# Altium project axidraw.PrjPcb
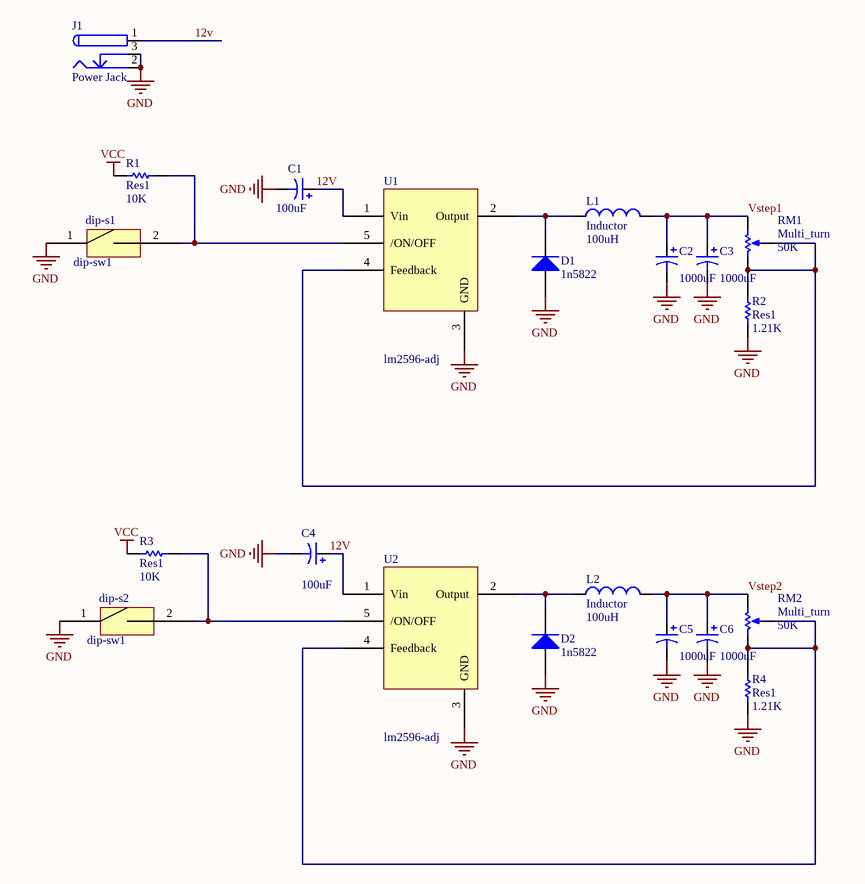
[diagram p0: power1.SchDoc]
6 sheets, 113 parts. Net scope: global (net labels, ports and power ports of the same name join across sheets).
Board file: plotter.PcbDoc
Sheets:
  power1.SchDoc
  power2.SchDoc
  step-drive.SchDoc
  accessory.SchDoc
  accessory2.SchDoc
  main.SchDoc

## Sheet power1.SchDoc
size A

### Parts
C1  value 100uF  [CAP ALUM 6.6MM]
C2  value 1000uF  [CAP ALUM 10.3MM]
C3  value 1000uF  [CAP ALUM 10.3MM]
C4  value 100uF  [CAP ALUM 6.6MM]
C5  value 1000uF  [CAP ALUM 10.3MM]
C6  value 1000uF  [CAP ALUM 10.3MM]
D1  1n5822  [DO214AC SMA]
D2  1n5822  [DO214AC SMA]
dip-s1  dip-sw1  [DIP2]
dip-s2  dip-sw1  [DIP2]
J1  Power Jack  [Power Jack]
L1  Inductor  value 100uH  [inductor - 12x12x7]
L2  Inductor  value 100uH  [inductor - 12x12x7]
R1  Res1  value 10K  [RES 1206/3216]
R2  Res1  value 1.21K  [RES 1206/3216]
R3  Res1  value 10K  [RES 1206/3216]
R4  Res1  value 1.21K  [RES 1206/3216]
RM1  Multi_turn  value 50K  [Multi Turn 02]
RM2  Multi_turn  value 50K  [Multi Turn 02]
U1  lm2596-adj  [DPAK170P1430X238-6N]
U2  lm2596-adj  [DPAK170P1430X238-6N]

### Nets
GND: C1.2 C2.2 C3.2 C4.2 C5.2 C6.2 D1.1(A) D2.1(A) dip-s1.1(k) dip-s2.1(k) J1.2 J1.3 R2.1 R4.1 U1.3(GND) U2.3(GND)
Vcc: R1.2 R3.2
12V: C1.1 C4.1 J1.1 U1.1(Vin) U2.1(Vin)
Vstep1: C2.1 C3.1 L1.2 RM1.1(TOP)
Vstep2: C5.1 C6.1 L2.2 RM2.1(TOP)
NetD1_2: D1.2(K) L1.1 U1.2(Output)
NetD2_2: D2.2(K) L2.1 U2.2(Output)
Netdip-s1_2: dip-s1.2(k) R1.1 U1.5(/ON/OFF)
Netdip-s2_2: dip-s2.2(k) R3.1 U2.5(/ON/OFF)
NetR2_2: R2.2 RM1.2(BOT) RM1.3(TAP) U1.4(Feedback)
NetR4_2: R4.2 RM2.2(BOT) RM2.3(TAP) U2.4(Feedback)

### Library data of the parts
C1-C6 = Cap Pol1: Polarized Capacitor (Radial); Published: 8-Jun-2000; LatestRevisionDate: 17-Jul-2002; LatestRevisionNote: Re-released for DXP Platform.; PackageReference: RB7.6-15; Publisher: Altium Limited; PackageDescription: Polarized Capacitor (Radial); 2 Leads
D1 D2 = Diode 1N4007: 1 Amp General Purpose Rectifier; Published: 8-Jun-2000; LatestRevisionDate: 17-Jul-2002; LatestRevisionNote: Re-released for DXP Platform.; DatasheetVersion: 1998; PackageVersion: Aug-1999; PackageReference: DO-41; Publisher: Altium Limited; PackageDescription: Diode, Axial; Body 5.2 x 2.7 mm (LxDia. max), Lead Dia. 0.86 mm (max); Code_JEDEC: DO-204-AL; ComponentLink1Description: Manufacturer Link; ComponentLink1URL: http://www.fairchildsemi.com/; ComponentLink2Description: Datasheet; ComponentLink2URL: http://www.fairchildsemi.com/ds/1N%2F1N4001.pdf
J1 = Power Jack: Designer: Saeid Jorablo; Company: Personal; Project Name: Laser; Adding Date: 10/21/2009
L1 L2 = Inductor: Code_IEC: 1005; Published: 8-Jun-2000; LatestRevisionDate: 29-May-2009; LatestRevisionNote: IPC-7351 Footprint Added.; PackageReference: 0402-A; Publisher: Altium Limited; PackageDescription: Chip Inductor; Code_JEITA: 0402
R1-R4 = Res1: Resistor; Published: 8-Jun-2000; LatestRevisionDate: 17-Jul-2002; LatestRevisionNote: Re-released for DXP Platform.; PackageReference: AXIAL-0.3; Publisher: Altium Limited; PackageDescription: Axial Device, Thru-Hole; 2 Leads; 0.3 in Pin Spacing
RM1 RM2 = Multi_turn: Potentiometer; Sim Note: Enter the Resistance value and the set point into parameter fields.; Set Position: 0.5; Published: 8-Jun-2000; LatestRevisionDate: 17-Jul-2002; LatestRevisionNote: Re-released for DXP Platform.; PackageReference: VR5; Publisher: Altium Limited
U1 U2 = lm2596

## Sheet power2.SchDoc
size A
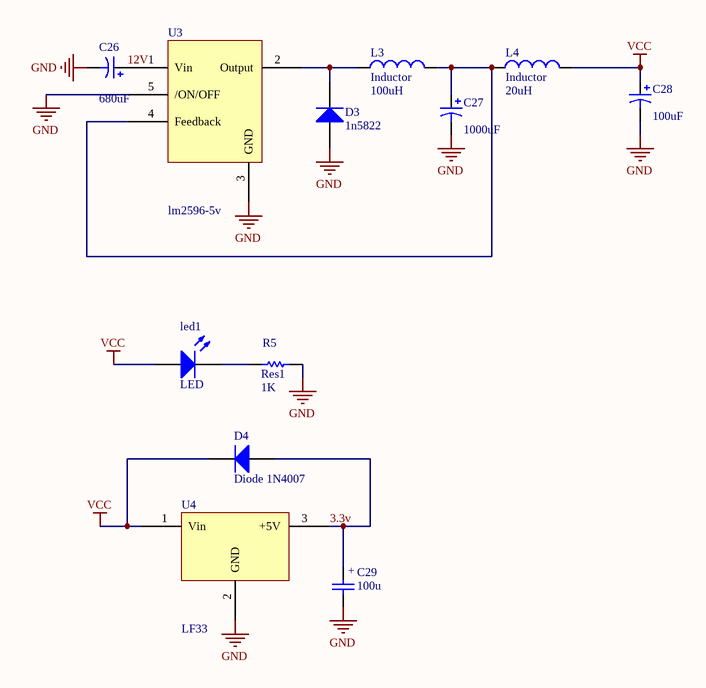
[diagram p1: power2.SchDoc]

### Parts
C26  value 680uF  [CAP ALUM 10.3MM]
C27  value 1000uF  [CAP ALUM 10.3MM]
C28  value 100uF  [CAP ALUM 6.6MM]
C29  value 100u  [CAP ALUM 6.6MM]  (hidden comment: Cap)
D3  1n5822  [DO214AC SMA]
D4  Diode 1N4007  [DO214AC SMA]
L3  Inductor  value 100uH  [inductor - 12x12x7]
L4  Inductor  value 20uH  [inductor - 12x12x7]
led1  LED  [LED 1206/3216 RED]
R5  Res1  value 1K  [RES 1206/3216]
U3  lm2596-5v  [DPAK170P1430X238-6N]
U4  LF33  [REG-7805-WALL]

### Nets
GND: C26.2 C27.2 C28.2 C29.- D3.1(A) R5.2 U3.3(GND) U3.5(/ON/OFF) U4.2(GND)
Vcc: C28.1 D4.2(K) L4.2 led1.A U4.1(Vin)
3.3v: C29.+ D4.1(A) U4.3(+5V)
12V: C26.1 U3.1(Vin)
NetC27_1: C27.1 L3.2 L4.1 U3.4(Feedback)
NetD3_2: D3.2(K) L3.1 U3.2(Output)
Netled1_K: led1.K R5.1

### Library data of the parts
C26-C28 = Cap Pol1: Polarized Capacitor (Radial); Published: 8-Jun-2000; LatestRevisionDate: 17-Jul-2002; LatestRevisionNote: Re-released for DXP Platform.; PackageReference: RB7.6-15; Publisher: Altium Limited; PackageDescription: Polarized Capacitor (Radial); 2 Leads
C29 = Cap Pol: CAP-3300Uf; pin to pad: +>1 ->2
D3 D4 = Diode 1N4007: 1 Amp General Purpose Rectifier; Published: 8-Jun-2000; LatestRevisionDate: 17-Jul-2002; LatestRevisionNote: Re-released for DXP Platform.; DatasheetVersion: 1998; PackageVersion: Aug-1999; PackageReference: DO-41; Publisher: Altium Limited; PackageDescription: Diode, Axial; Body 5.2 x 2.7 mm (LxDia. max), Lead Dia. 0.86 mm (max); Code_JEDEC: DO-204-AL; ComponentLink1Description: Manufacturer Link; ComponentLink1URL: http://www.fairchildsemi.com/; ComponentLink2Description: Datasheet; ComponentLink2URL: http://www.fairchildsemi.com/ds/1N%2F1N4001.pdf
L3 L4 = Inductor: Code_IEC: 1005; Published: 8-Jun-2000; LatestRevisionDate: 29-May-2009; LatestRevisionNote: IPC-7351 Footprint Added.; PackageReference: 0402-A; Publisher: Altium Limited; PackageDescription: Chip Inductor; Code_JEITA: 0402
led1 = LED: Typical INFRARED GaAs LED; pin to pad: A>1 K>2; Published: 8-Jun-2000; LatestRevisionDate: 08-Jul-2005; LatestRevisionNote: Mech Layer 1 removed.; Publisher: Altium Limited
R5 = Res1: Resistor; Published: 8-Jun-2000; LatestRevisionDate: 17-Jul-2002; LatestRevisionNote: Re-released for DXP Platform.; PackageReference: AXIAL-0.3; Publisher: Altium Limited; PackageDescription: Axial Device, Thru-Hole; 2 Leads; 0.3 in Pin Spacing
U3 = lm2596
U4 = 7805: Regulator

## Sheet step-drive.SchDoc
size A
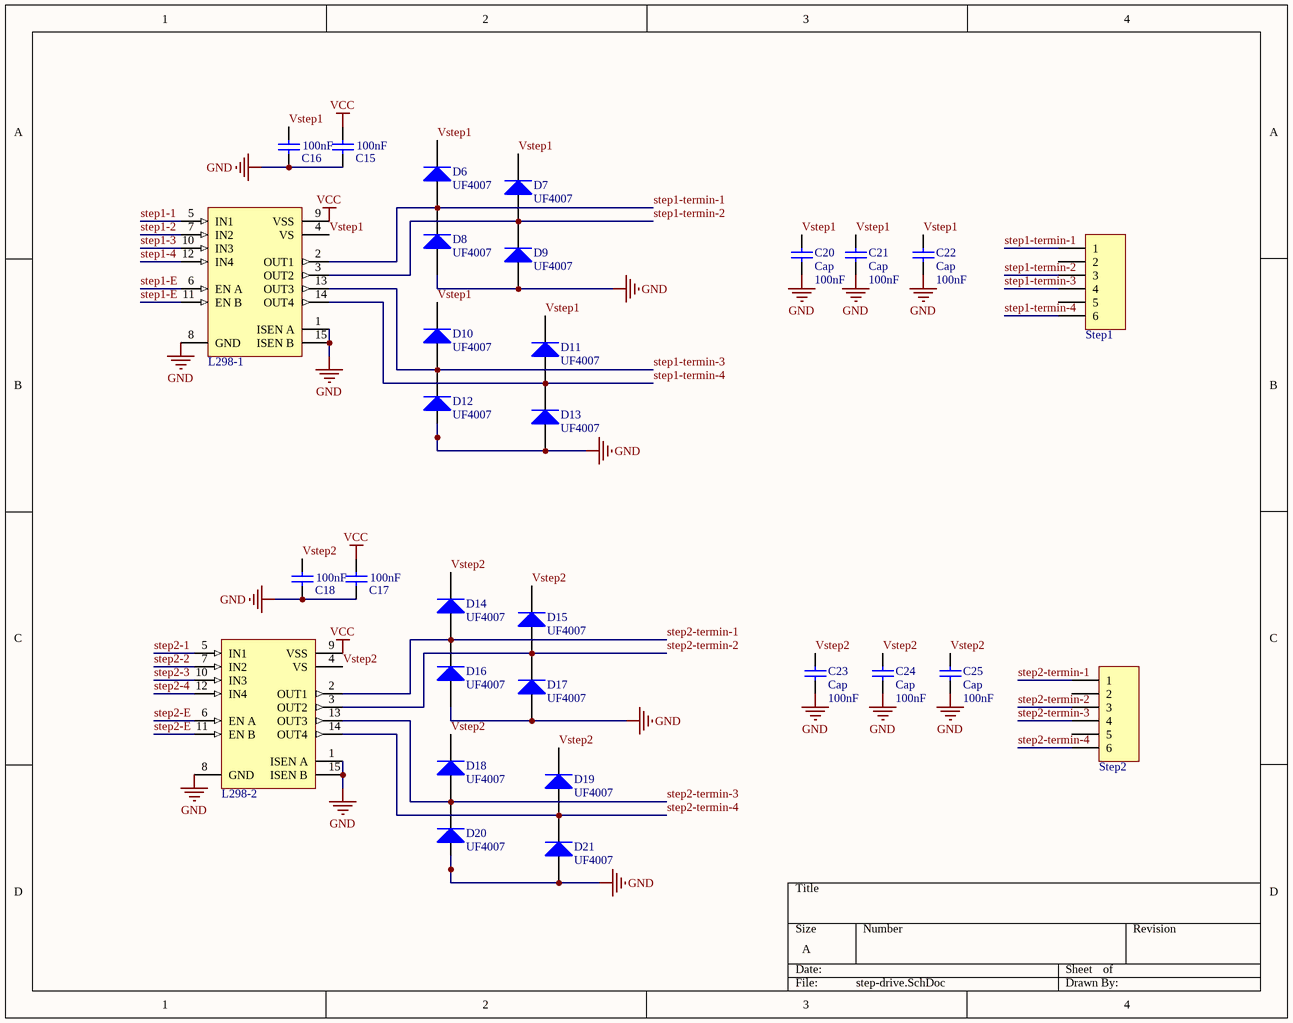
[diagram p2: step-drive.SchDoc]

### Parts
C15  100nF  [CAP 1206/3216 - 0.8MM]
C16  100nF  [CAP 1206/3216 - 0.8MM]
C17  100nF  [CAP 1206/3216 - 0.8MM]
C18  100nF  [CAP 1206/3216 - 0.8MM]
C20  Cap  value 100nF  [CAP 1206/3216 - 0.8MM]
C21  Cap  value 100nF  [CAP 1206/3216 - 0.8MM]
C22  Cap  value 100nF  [CAP 1206/3216 - 0.8MM]
C23  Cap  value 100nF  [CAP 1206/3216 - 0.8MM]
C24  Cap  value 100nF  [CAP 1206/3216 - 0.8MM]
C25  Cap  value 100nF  [CAP 1206/3216 - 0.8MM]
D6  UF4007  [DO214AC SMA]
D7  UF4007  [DO214AC SMA]
D8  UF4007  [DO214AC SMA]
D9  UF4007  [DO214AC SMA]
D10  UF4007  [DO214AC SMA]
D11  UF4007  [DO214AC SMA]
D12  UF4007  [DO214AC SMA]
D13  UF4007  [DO214AC SMA]
D14  UF4007  [DO214AC SMA]
D15  UF4007  [DO214AC SMA]
D16  UF4007  [DO214AC SMA]
D17  UF4007  [DO214AC SMA]
D18  UF4007  [DO214AC SMA]
D19  UF4007  [DO214AC SMA]
D20  UF4007  [DO214AC SMA]
D21  UF4007  [DO214AC SMA]
L298-1  L298  [L298]  (value not drawn)
L298-2  L298  [L298]  (value not drawn)
Step1  H-1x6  [H-1x6]  (value not drawn)
Step2  H-1x6  [H-1x6]  (value not drawn)

### Nets
GND: C15.1 C16.1 C17.1 C18.1 C20.2 C21.2 C22.2 C23.2 C24.2 C25.2 D8.1(A) D9.1(A) D12.1(A) D13.1(A) D16.1(A) D17.1(A) D20.1(A) D21.1(A) L298-1.1(ISEN_A) L298-1.8(GND) L298-1.15(ISEN_B) L298-2.1(ISEN_A) L298-2.8(GND) L298-2.15(ISEN_B)
Vcc: C15.2 C17.2 L298-1.9(VSS) L298-2.9(VSS)
step1-1: L298-1.5(IN1)
step1-2: L298-1.7(IN2)
step1-3: L298-1.10(IN3)
step1-4: L298-1.12(IN4)
step1-E: L298-1.6(EN_A) L298-1.11(EN_B)
step1-termin-1: D6.1(A) D8.2(K) L298-1.2(OUT1) Step1.1
step1-termin-2: D7.1(A) D9.2(K) L298-1.3(OUT2) Step1.3
step1-termin-3: D10.1(A) D12.2(K) L298-1.13(OUT3) Step1.4
step1-termin-4: D11.1(A) D13.2(K) L298-1.14(OUT4) Step1.6
step2-1: L298-2.5(IN1)
step2-2: L298-2.7(IN2)
step2-3: L298-2.10(IN3)
step2-4: L298-2.12(IN4)
step2-E: L298-2.6(EN_A) L298-2.11(EN_B)
step2-termin-1: D14.1(A) D16.2(K) L298-2.2(OUT1) Step2.1
step2-termin-2: D15.1(A) D17.2(K) L298-2.3(OUT2) Step2.3
step2-termin-3: D18.1(A) D20.2(K) L298-2.13(OUT3) Step2.4
step2-termin-4: D19.1(A) D21.2(K) L298-2.14(OUT4) Step2.6
Vstep1: C16.2 C20.1 C21.1 C22.1 D6.2(K) D7.2(K) D10.2(K) D11.2(K) L298-1.4(VS)
Vstep2: C18.2 C23.1 C24.1 C25.1 D14.2(K) D15.2(K) D18.2(K) D19.2(K) L298-2.4(VS)

Not connected (* = marked no-connect by the designer): Step1 2 5; Step2 2 5

### Library data of the parts
C15-C18 C20-C25 = Cap ceramic: CAP-100Nf
  C15-C18: Value: 100nF
D6-D21 = Diode 1N4007: 1 Amp General Purpose Rectifier; Published: 8-Jun-2000; LatestRevisionDate: 17-Jul-2002; LatestRevisionNote: Re-released for DXP Platform.; DatasheetVersion: 1998; PackageVersion: Aug-1999; PackageReference: DO-41; Publisher: Altium Limited; PackageDescription: Diode, Axial; Body 5.2 x 2.7 mm (LxDia. max), Lead Dia. 0.86 mm (max); Code_JEDEC: DO-204-AL; ComponentLink1Description: Manufacturer Link; ComponentLink1URL: http://www.fairchildsemi.com/; ComponentLink2Description: Datasheet; ComponentLink2URL: http://www.fairchildsemi.com/ds/1N%2F1N4001.pdf

## Sheet accessory.SchDoc
size A
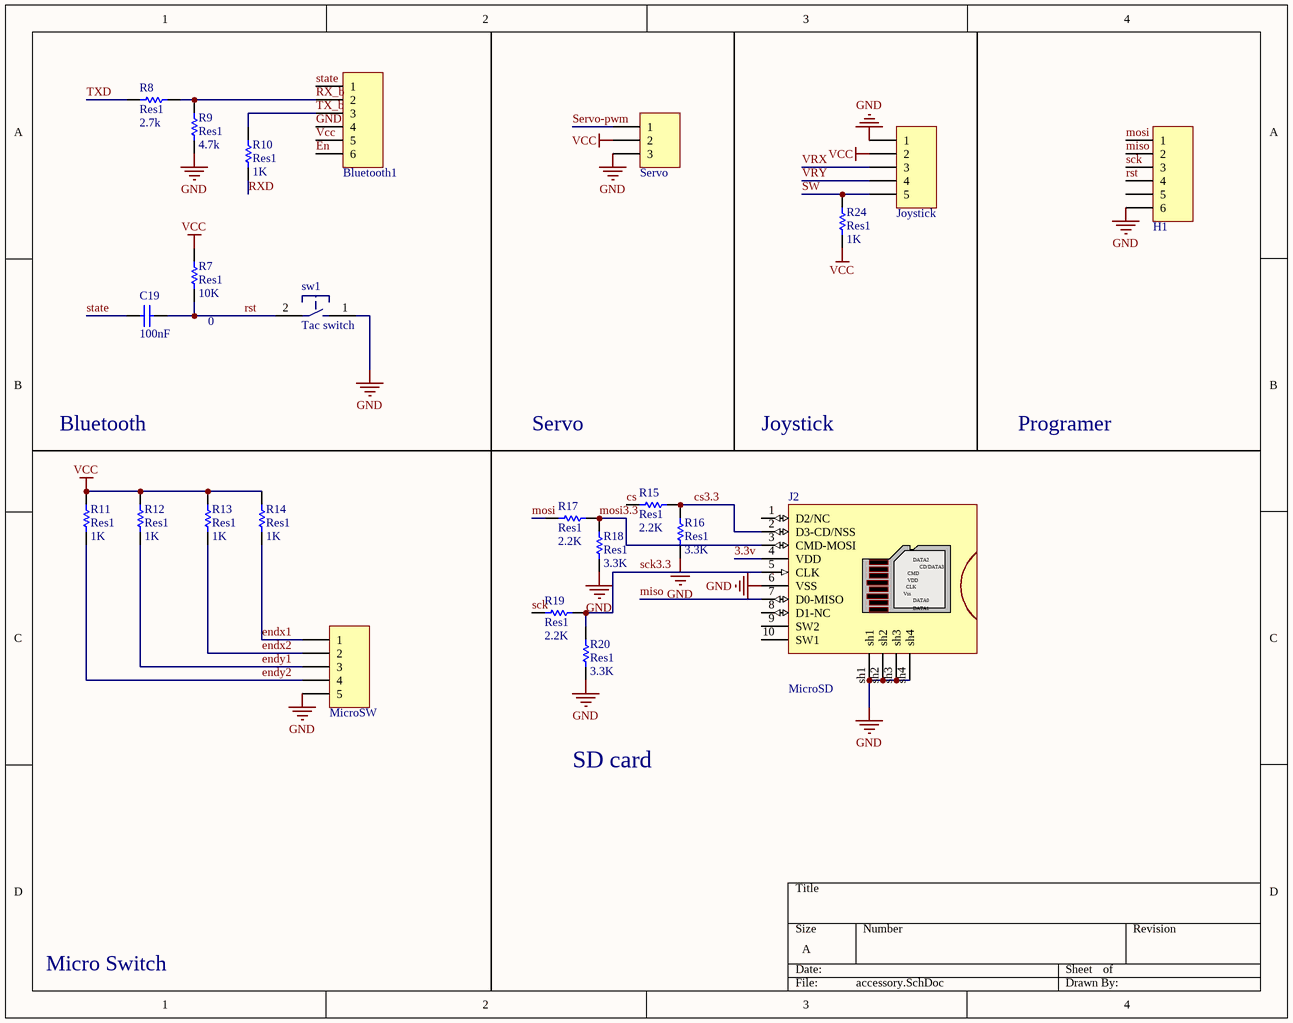
[diagram p3: accessory.SchDoc]

### Parts
Bluetooth1  H-1x6  [H-1x6]  (value not drawn)
C19  value 100nF  [CAP 1206/3216 - 0.8MM]  (hidden comment: Cap)
H1  H-1x6  [H-1x6]  (value not drawn)
J2  MicroSD  [MicroSD_1]
Joystick  H-1x5  [H-1x5]  (value not drawn)
MicroSW  H-1x5  [H-1x5]  (value not drawn)
R7  Res1  value 10K  [RES 1206/3216]
R8  Res1  value 2.7k  [RES 1206/3216]
R9  Res1  value 4.7k  [RES 1206/3216]
R10  Res1  value 1K  [RES 1206/3216]
R11  Res1  value 1K  [RES 1206/3216]
R12  Res1  value 1K  [RES 1206/3216]
R13  Res1  value 1K  [RES 1206/3216]
R14  Res1  value 1K  [RES 1206/3216]
R15  Res1  value 2.2K  [RES 1206/3216]
R16  Res1  value 3.3K  [RES 1206/3216]
R17  Res1  value 2.2K  [RES 1206/3216]
R18  Res1  value 3.3K  [RES 1206/3216]
R19  Res1  value 2.2K  [RES 1206/3216]
R20  Res1  value 3.3K  [RES 1206/3216]
R24  Res1  value 1K  [RES 1206/3216]
Servo  H-1x3  [H-1x3]  (value not drawn)
sw1  Tac switch  [MY_TACTILE-PTH]

### Nets
GND: Bluetooth1.4 H1.6 J2.6(VSS) J2.sh1 J2.sh2 J2.sh3 J2.sh4 Joystick.1 MicroSW.5 R9.1 R16.2 R18.1 R20.1 Servo.3 sw1.1
Vcc: Bluetooth1.5 Joystick.2 R7.2 R11.2 R12.2 R13.2 R14.2 R24.1 Servo.2
3.3v: J2.4(VDD)
cs: R15.2
cs3.3: J2.2(D3-CD/NSS) R15.1 R16.1
En: Bluetooth1.6
endx1: MicroSW.1 R14.1
endx2: MicroSW.2 R13.1
endy1: MicroSW.3 R12.1
endy2: MicroSW.4 R11.1
miso: H1.2 J2.7(D0-MISO)
mosi: H1.1 R17.1
mosi3.3: J2.3(CMD-MOSI) R17.2 R18.2
rst: C19.2 H1.4 R7.1 sw1.2
RX_b: Bluetooth1.2 R8.2 R9.2
RXD: R10.2
sck: H1.3 R19.1
sck3.3: J2.5(CLK) R19.2 R20.2
Servo-pwm: Servo.1
state: Bluetooth1.1 C19.1
SW: Joystick.5 R24.2
TX_b: Bluetooth1.3 R10.1
TXD: R8.1
VRX: Joystick.3
VRY: Joystick.4

Not connected (* = marked no-connect by the designer): H1 5; J2 1(D2/NC) 8(D1-NC) 9(SW2) 10(SW1)

### Notes on the sheet
- (near R7) 0
- Bluetooth
- Servo
- Joystick
- Programer
- SD card
- Micro Switch
- (in symbol MicroSD) DATA2; CD/DATA3; CMD; Vss; DATA0; DATA1

### Library data of the parts
Bluetooth1 H1 = H-1x6: pin to pad: 2>2.5
C19 = Cap ceramic: CAP-100Nf
J2 = MicroSD: MicroSD_altium designer (M.Hariri); Created by:: altium designer (M.Hariri); VALUE: MicroSD
R7-R20 R24 = Res1: Resistor; Published: 8-Jun-2000; LatestRevisionDate: 17-Jul-2002; LatestRevisionNote: Re-released for DXP Platform.; PackageReference: AXIAL-0.3; Publisher: Altium Limited; PackageDescription: Axial Device, Thru-Hole; 2 Leads; 0.3 in Pin Spacing
sw1 = Tac switch: small tac switch

## Sheet accessory2.SchDoc
size A
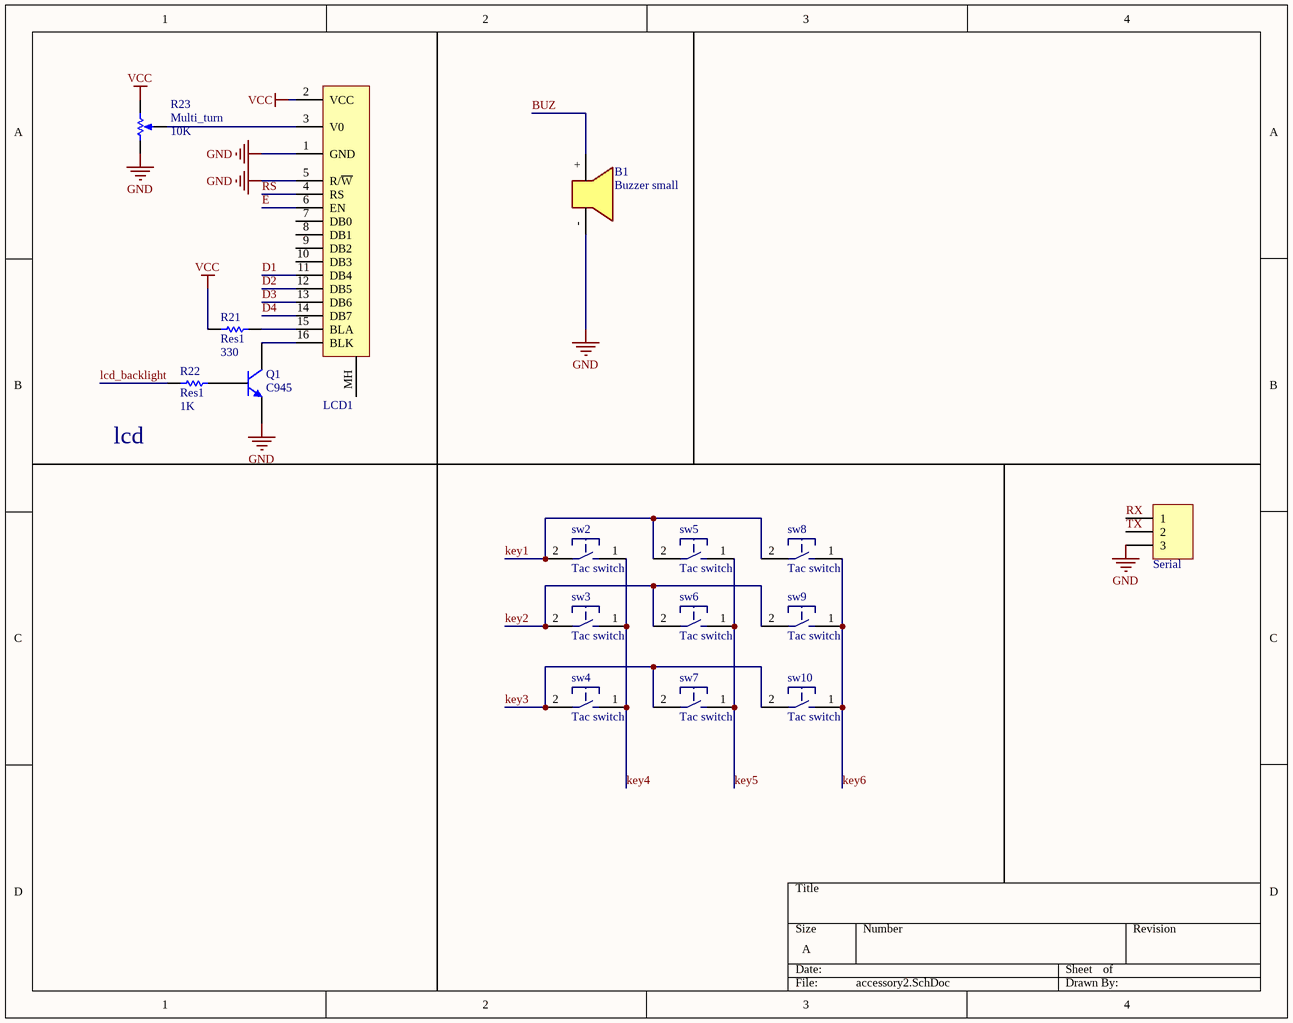
[diagram p4: accessory2.SchDoc]

### Parts
B1  Buzzer small  [My_Buzzer]
LCD1  20x4  [LCD 16x2]  (value not drawn)
Q1  C945  [SOT23_L]
R21  Res1  value 330  [RES 1206/3216]
R22  Res1  value 1K  [RES 1206/3216]
R23  Multi_turn  value 10K  [My_Pot_trim]
Serial  H-1x3  [H-1x3]  (value not drawn)
sw2  Tac switch  [MY_TACTILE-PTH]
sw3  Tac switch  [MY_TACTILE-PTH]
sw4  Tac switch  [MY_TACTILE-PTH]
sw5  Tac switch  [MY_TACTILE-PTH]
sw6  Tac switch  [MY_TACTILE-PTH]
sw7  Tac switch  [MY_TACTILE-PTH]
sw8  Tac switch  [MY_TACTILE-PTH]
sw9  Tac switch  [MY_TACTILE-PTH]
sw10  Tac switch  [MY_TACTILE-PTH]

### Nets
GND: B1.- LCD1.1(GND) LCD1.5(R/~{W}) Q1.1(E) R23.1(TOP) Serial.3
Vcc: LCD1.2(VCC) R21.1 R23.2(BOT)
BUZ: B1.+
D1: LCD1.11(DB4)
D2: LCD1.12(DB5)
D3: LCD1.13(DB6)
D4: LCD1.14(DB7)
E: LCD1.6(EN)
key1: sw2.2 sw5.2 sw8.2
key2: sw3.2 sw6.2 sw9.2
key3: sw4.2 sw7.2 sw10.2
key4: sw2.1 sw3.1 sw4.1
key5: sw5.1 sw6.1 sw7.1
key6: sw8.1 sw9.1 sw10.1
lcd_backlight: R22.1
RS: LCD1.4(RS)
RX: Serial.1
TX: Serial.2
NetLCD1_3: LCD1.3(V0) R23.3(TAP)
NetLCD1_15: LCD1.15(BLA) R21.2
NetLCD1_16: LCD1.16(BLK) Q1.2(C)
NetQ1_3: Q1.3(B) R22.2

Not connected (* = marked no-connect by the designer): LCD1 7(DB0) 8(DB1) 9(DB2) 10(DB3) MH

### Notes on the sheet
- (near R22) lcd

### Library data of the parts
B1 = Buzzer: 5-12v small buzzer (12mm)
LCD1 = LCD: Designer: Saeid Jorablo; Company: My self; Adding Date: 10/21/2009; LCDType: 20x4
Q1 = C945: NPN Transistor; pin to pad: 1>2 2>1; Designer: Saeid Jorablo; Company: IPA CO; Last Update Time: 2008/08/04; Value: C945
R21 R22 = Res1: Resistor; Published: 8-Jun-2000; LatestRevisionDate: 17-Jul-2002; LatestRevisionNote: Re-released for DXP Platform.; PackageReference: AXIAL-0.3; Publisher: Altium Limited; PackageDescription: Axial Device, Thru-Hole; 2 Leads; 0.3 in Pin Spacing
R23 = Multi_turn: as RM1 on sheet power1; Published: 8-Jun-2000; LatestRevisionDate: 17-Jul-2002; LatestRevisionNote: Re-released for DXP Platform.; PackageReference: VR5; Publisher: Altium Limited
sw2-sw10 = Tac switch: small tac switch

## Sheet main.SchDoc
size A
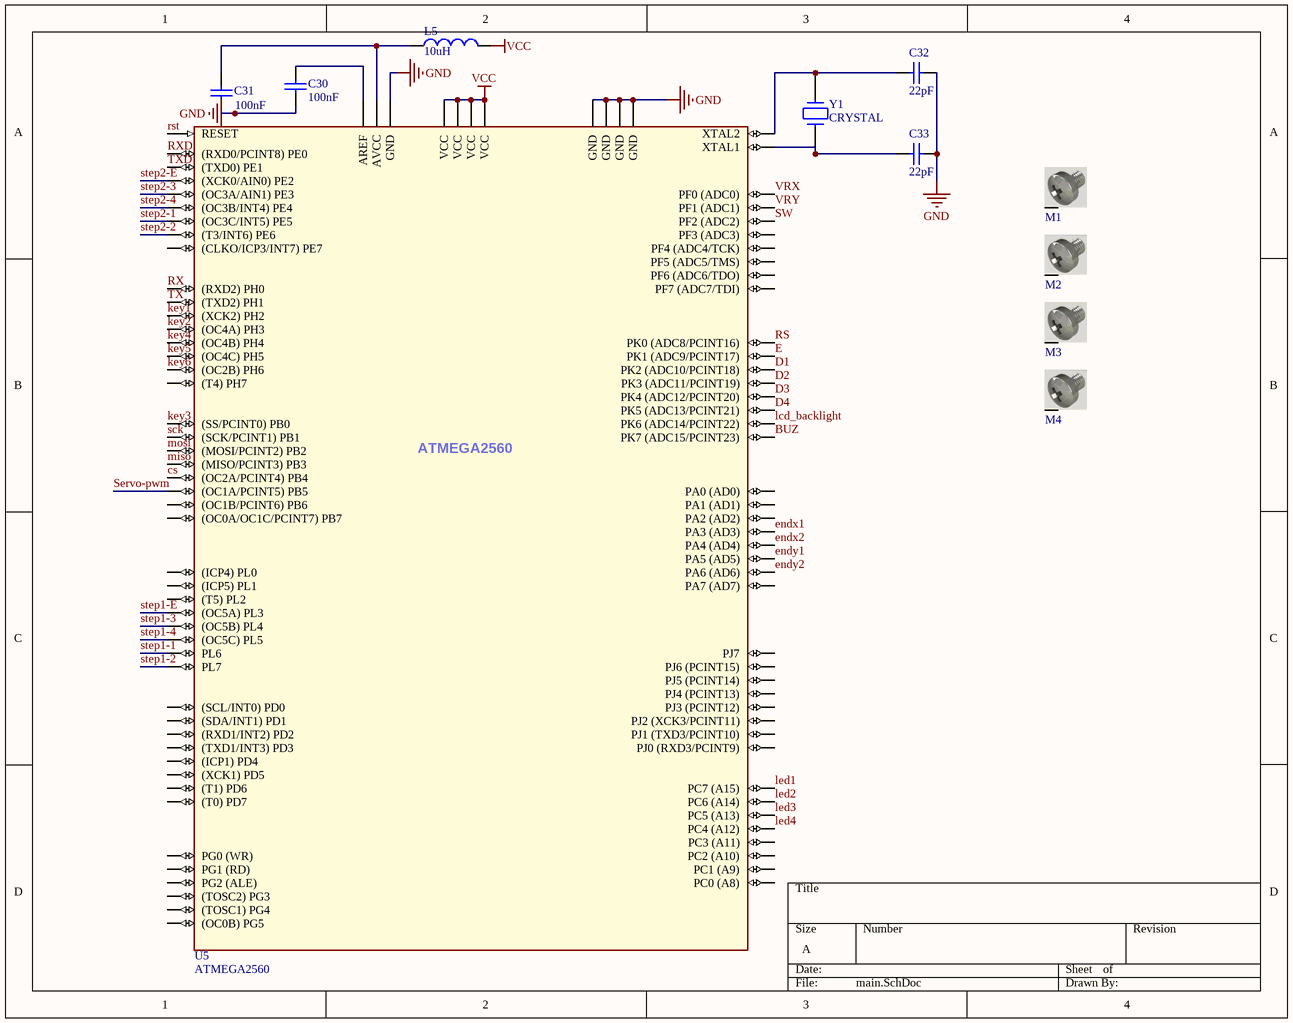
[diagram p5: main.SchDoc]

### Parts
C30  value 100nF  [CAP 1206/3216 - 0.8MM]  (hidden comment: Cap)
C31  value 100nF  [CAP 1206/3216 - 0.8MM]  (hidden comment: Cap)
C32  value 22pF  [CAP 1206/3216 - 0.8MM]  (hidden comment: Cap)
C33  value 22pF  [CAP 1206/3216 - 0.8MM]  (hidden comment: Cap)
L5  value 10uH  [C1210_M]  (hidden comment: Inductor)
M1  Screw  [Board Screw]  (value not drawn)
M2  Screw  [Board Screw]  (value not drawn)
M3  Screw  [Board Screw]  (value not drawn)
M4  Screw  [Board Screw]  (value not drawn)
U5  ATMEGA2560  [MY_ATMEGA2560]
Y1  CRYSTAL  [My_Crystal]

### Nets
GND: C30.1 C31.1 C32.2 C33.2 U5.11(GND) U5.32(GND) U5.62(GND) U5.81(GND) U5.99(GND)
Vcc: L5.2 U5.10(VCC) U5.31(VCC) U5.61(VCC) U5.80(VCC)
BUZ: U5.82(PK7_(ADC15/PCINT23))
cs: U5.23((OC2A/PCINT4)_PB4)
D1: U5.87(PK2_(ADC10/PCINT18))
D2: U5.86(PK3_(ADC11/PCINT19))
D3: U5.85(PK4_(ADC12/PCINT20))
D4: U5.84(PK5_(ADC13/PCINT21))
E: U5.88(PK1_(ADC9/PCINT17))
endx1: U5.75(PA3_(AD3))
endx2: U5.74(PA4_(AD4))
endy1: U5.73(PA5_(AD5))
endy2: U5.72(PA6_(AD6))
key1: U5.14((XCK2)_PH2)
key2: U5.15((OC4A)_PH3)
key3: U5.19((SS/PCINT0)_PB0)
key4: U5.16((OC4B)_PH4)
key5: U5.17((OC4C)_PH5)
key6: U5.18((OC2B)_PH6)
lcd_backlight: U5.83(PK6_(ADC14/PCINT22))
led1: U5.60(PC7_(A15))
led2: U5.59(PC6_(A14))
led3: U5.58(PC5_(A13))
led4: U5.57(PC4_(A12))
miso: U5.22((MISO/PCINT3)_PB3)
mosi: U5.21((MOSI/PCINT2)_PB2)
RS: U5.89(PK0_(ADC8/PCINT16))
rst: U5.30(RESET)
RX: U5.12((RXD2)_PH0)
RXD: U5.2((RXD0/PCINT8)_PE0)
sck: U5.20((SCK/PCINT1)_PB1)
Servo-pwm: U5.24((OC1A/PCINT5)_PB5)
step1-1: U5.41(PL6)
step1-2: U5.42(PL7)
step1-3: U5.39((OC5B)_PL4)
step1-4: U5.40((OC5C)_PL5)
step1-E: U5.38((OC5A)_PL3)
step2-1: U5.7((OC3C/INT5)_PE5)
step2-2: U5.8((T3/INT6)_PE6)
step2-3: U5.5((OC3A/AIN1)_PE3)
step2-4: U5.6((OC3B/INT4)_PE4)
step2-E: U5.4((XCK0/AIN0)_PE2)
SW: U5.95(PF2_(ADC2))
TX: U5.13((TXD2)_PH1)
TXD: U5.3((TXD0)_PE1)
VRX: U5.97(PF0_(ADC0))
VRY: U5.96(PF1_(ADC1))
NetC30_2: C30.2 U5.98(AREF)
NetC31_2: C31.2 L5.1 U5.100(AVCC)
NetC32_1: C32.1 U5.33(XTAL2) Y1.1
NetC33_1: C33.1 U5.34(XTAL1) Y1.2

Not connected (* = marked no-connect by the designer): M1 S; M2 S; M3 S; M4 S; U5 1((OC0B)_PG5) 9((CLKO/ICP3/INT7)_PE7) 25((OC1B/PCINT6)_PB6) 26((OC0A/OC1C/PCINT7)_PB7) 27((T4)_PH7) 28((TOSC2)_PG3) 29((TOSC1)_PG4) 35((ICP4)_PL0) 36((ICP5)_PL1) 37((T5)_PL2) 43((SCL/INT0)_PD0) 44((SDA/INT1)_PD1) 45((RXD1/INT2)_PD2) 46((TXD1/INT3)_PD3) 47((ICP1)_PD4) 48((XCK1)_PD5) 49((T1)_PD6) 50((T0)_PD7) 51(PG0_(WR)) 52(PG1_(RD)) 53(PC0_(A8)) 54(PC1_(A9)) 55(PC2_(A10)) 56(PC3_(A11)) 63(PJ0_(RXD3/PCINT9)) 64(PJ1_(TXD3/PCINT10)) 65(PJ2_(XCK3/PCINT11)) 66(PJ3_(PCINT12)) 67(PJ4_(PCINT13)) 68(PJ5_(PCINT14)) 69(PJ6_(PCINT15)) 70(PG2_(ALE)) 71(PA7_(AD7)) 76(PA2_(AD2)) 77(PA1_(AD1)) 78(PA0_(AD0)) 79(PJ7) 90(PF7_(ADC7/TDI)) 91(PF6_(ADC6/TDO)) 92(PF5_(ADC5/TMS)) 93(PF4_(ADC4/TCK)) 94(PF3_(ADC3))

### Library data of the parts
C30-C33 = Cap ceramic: CAP-100Nf
L5 = Inductor: Code_IEC: 1005; Published: 8-Jun-2000; LatestRevisionDate: 29-May-2009; LatestRevisionNote: IPC-7351 Footprint Added.; PackageReference: 0402-A; Publisher: Altium Limited; PackageDescription: Chip Inductor; Code_JEITA: 0402
M1-M4 = Board Screw: Board Screw With Spacer
U5 = ATMEGA2560: AVR 256K Bytes of In-System Programmable Flash Memory

## Nets that join several sheets
GND: power1 (16 pins), power2 (9 pins), step-drive (24 pins), accessory (15 pins), accessory2 (6 pins), main (9 pins)
Vcc: power1 (R1.2 R3.2), power2 (5 pins), step-drive (C15.2 C17.2 L298-1.9 L298-2.9), accessory (9 pins), accessory2 (LCD1.2 R21.1 R23.2), main (5 pins)
3.3v: power2 (C29.+ D4.1 U4.3), accessory (J2.4)
12V: power1 (5 pins), power2 (C26.1 U3.1)
BUZ: accessory2 (B1.+), main (U5.82)
cs: accessory (R15.2), main (U5.23)
D1: accessory2 (LCD1.11), main (U5.87)
D2: accessory2 (LCD1.12), main (U5.86)
D3: accessory2 (LCD1.13), main (U5.85)
D4: accessory2 (LCD1.14), main (U5.84)
E: accessory2 (LCD1.6), main (U5.88)
endx1: accessory (MicroSW.1 R14.1), main (U5.75)
endx2: accessory (MicroSW.2 R13.1), main (U5.74)
endy1: accessory (MicroSW.3 R12.1), main (U5.73)
endy2: accessory (MicroSW.4 R11.1), main (U5.72)
key1: accessory2 (sw2.2 sw5.2 sw8.2), main (U5.14)
key2: accessory2 (sw3.2 sw6.2 sw9.2), main (U5.15)
key3: accessory2 (sw4.2 sw7.2 sw10.2), main (U5.19)
key4: accessory2 (sw2.1 sw3.1 sw4.1), main (U5.16)
key5: accessory2 (sw5.1 sw6.1 sw7.1), main (U5.17)
key6: accessory2 (sw8.1 sw9.1 sw10.1), main (U5.18)
lcd_backlight: accessory2 (R22.1), main (U5.83)
miso: accessory (H1.2 J2.7), main (U5.22)
mosi: accessory (H1.1 R17.1), main (U5.21)
RS: accessory2 (LCD1.4), main (U5.89)
rst: accessory (C19.2 H1.4 R7.1 sw1.2), main (U5.30)
RX: accessory2 (Serial.1), main (U5.12)
RXD: accessory (R10.2), main (U5.2)
sck: accessory (H1.3 R19.1), main (U5.20)
Servo-pwm: accessory (Servo.1), main (U5.24)
step1-1: step-drive (L298-1.5), main (U5.41)
step1-2: step-drive (L298-1.7), main (U5.42)
step1-3: step-drive (L298-1.10), main (U5.39)
step1-4: step-drive (L298-1.12), main (U5.40)
step1-E: step-drive (L298-1.6 L298-1.11), main (U5.38)
step2-1: step-drive (L298-2.5), main (U5.7)
step2-2: step-drive (L298-2.7), main (U5.8)
step2-3: step-drive (L298-2.10), main (U5.5)
step2-4: step-drive (L298-2.12), main (U5.6)
step2-E: step-drive (L298-2.6 L298-2.11), main (U5.4)
SW: accessory (Joystick.5 R24.2), main (U5.95)
TX: accessory2 (Serial.2), main (U5.13)
TXD: accessory (R8.1), main (U5.3)
VRX: accessory (Joystick.3), main (U5.97)
VRY: accessory (Joystick.4), main (U5.96)
Vstep1: power1 (C2.1 C3.1 L1.2 RM1.1), step-drive (9 pins)
Vstep2: power1 (C5.1 C6.1 L2.2 RM2.1), step-drive (9 pins)